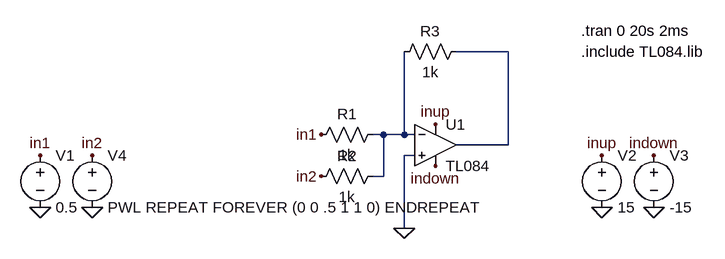
[diagram p0: schematic 06-Som.asc]
06-Som.asc, the LTspice schematic file:
Version 4
SHEET 1 880 680
WIRE 256 16 176 16
WIRE 64 144 48 144
WIRE 96 144 96 16
WIRE 96 144 64 144
WIRE 112 144 96 144
WIRE 256 160 256 16
WIRE 256 160 176 160
WIRE 112 176 96 176
WIRE 64 208 64 144
WIRE 64 208 48 208
WIRE 96 288 96 176
FLAG 400 256 0
FLAG 480 256 0
FLAG 400 176 inup
FLAG 144 128 inup
FLAG 480 176 indown
FLAG 144 192 indown
FLAG -464 256 0
FLAG -384 256 0
FLAG -464 176 in1
FLAG -384 176 in2
FLAG 96 288 0
FLAG -32 144 in1
FLAG -32 208 in2
SYMBOL Opamps\\opamp2 144 96 R0
SYMATTR InstName U1
SYMATTR Value TL084
SYMBOL voltage 400 160 R0
WINDOW 123 0 0 Left 0
WINDOW 39 0 0 Left 0
SYMATTR InstName V2
SYMATTR Value 15
SYMBOL voltage 480 160 R0
WINDOW 123 0 0 Left 0
WINDOW 39 0 0 Left 0
SYMATTR InstName V3
SYMATTR Value -15
SYMBOL voltage -464 160 R0
WINDOW 123 0 0 Left 0
WINDOW 39 0 0 Left 0
SYMATTR InstName V1
SYMATTR Value 0.5
SYMBOL voltage -384 160 R0
WINDOW 123 0 0 Left 0
WINDOW 39 0 0 Left 0
SYMATTR InstName V4
SYMATTR Value PWL REPEAT FOREVER (0 0 .5 1 1 0) ENDREPEAT
SYMBOL res 64 128 R90
WINDOW 0 0 56 VBottom 2
WINDOW 3 32 56 VTop 2
SYMATTR InstName R1
SYMATTR Value 1k
SYMBOL res 64 192 R90
WINDOW 0 0 56 VBottom 2
WINDOW 3 32 56 VTop 2
SYMATTR InstName R2
SYMATTR Value 1k
SYMBOL res 192 0 R90
WINDOW 0 0 56 VBottom 2
WINDOW 3 32 56 VTop 2
SYMATTR InstName R3
SYMATTR Value 1k
TEXT 368 -16 Left 2 !.tran 0 20s 2ms
TEXT 368 16 Left 2 !.include TL084.lib

The netlist it stands for:
* 06-Som.asc
XU1 0 N002 inup indown N001 TL084  ; pins In+ In- V+ V- OUT
V2 inup 0 15
V3 indown 0 -15
V1 in1 0 0.5
V4 in2 0 PWL REPEAT FOREVER (0 0 .5 1 1 0) ENDREPEAT
R1 N002 in1 1k
R2 N002 in2 1k
R3 N001 N002 1k
.tran 0 20s 2ms
.include TL084.lib
.backanno
.end